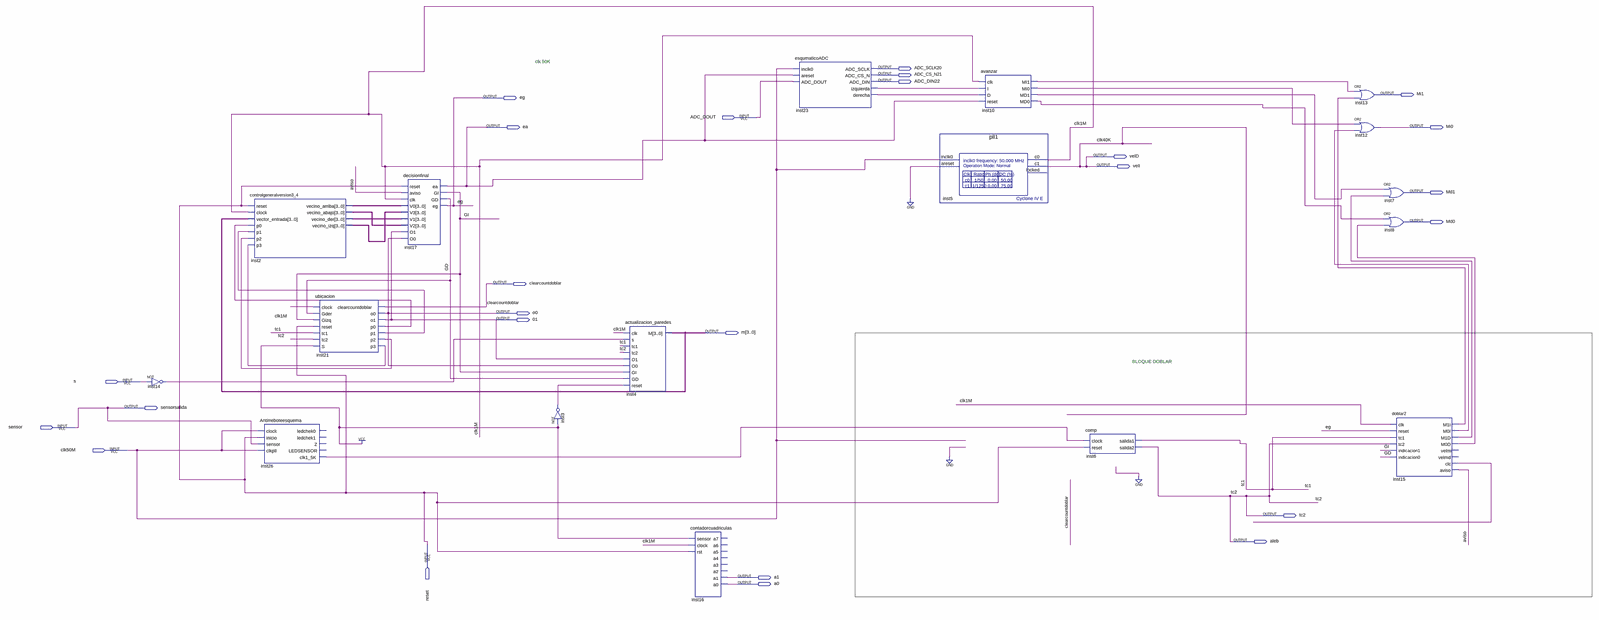
[diagram p0: schematic sheet, whole]
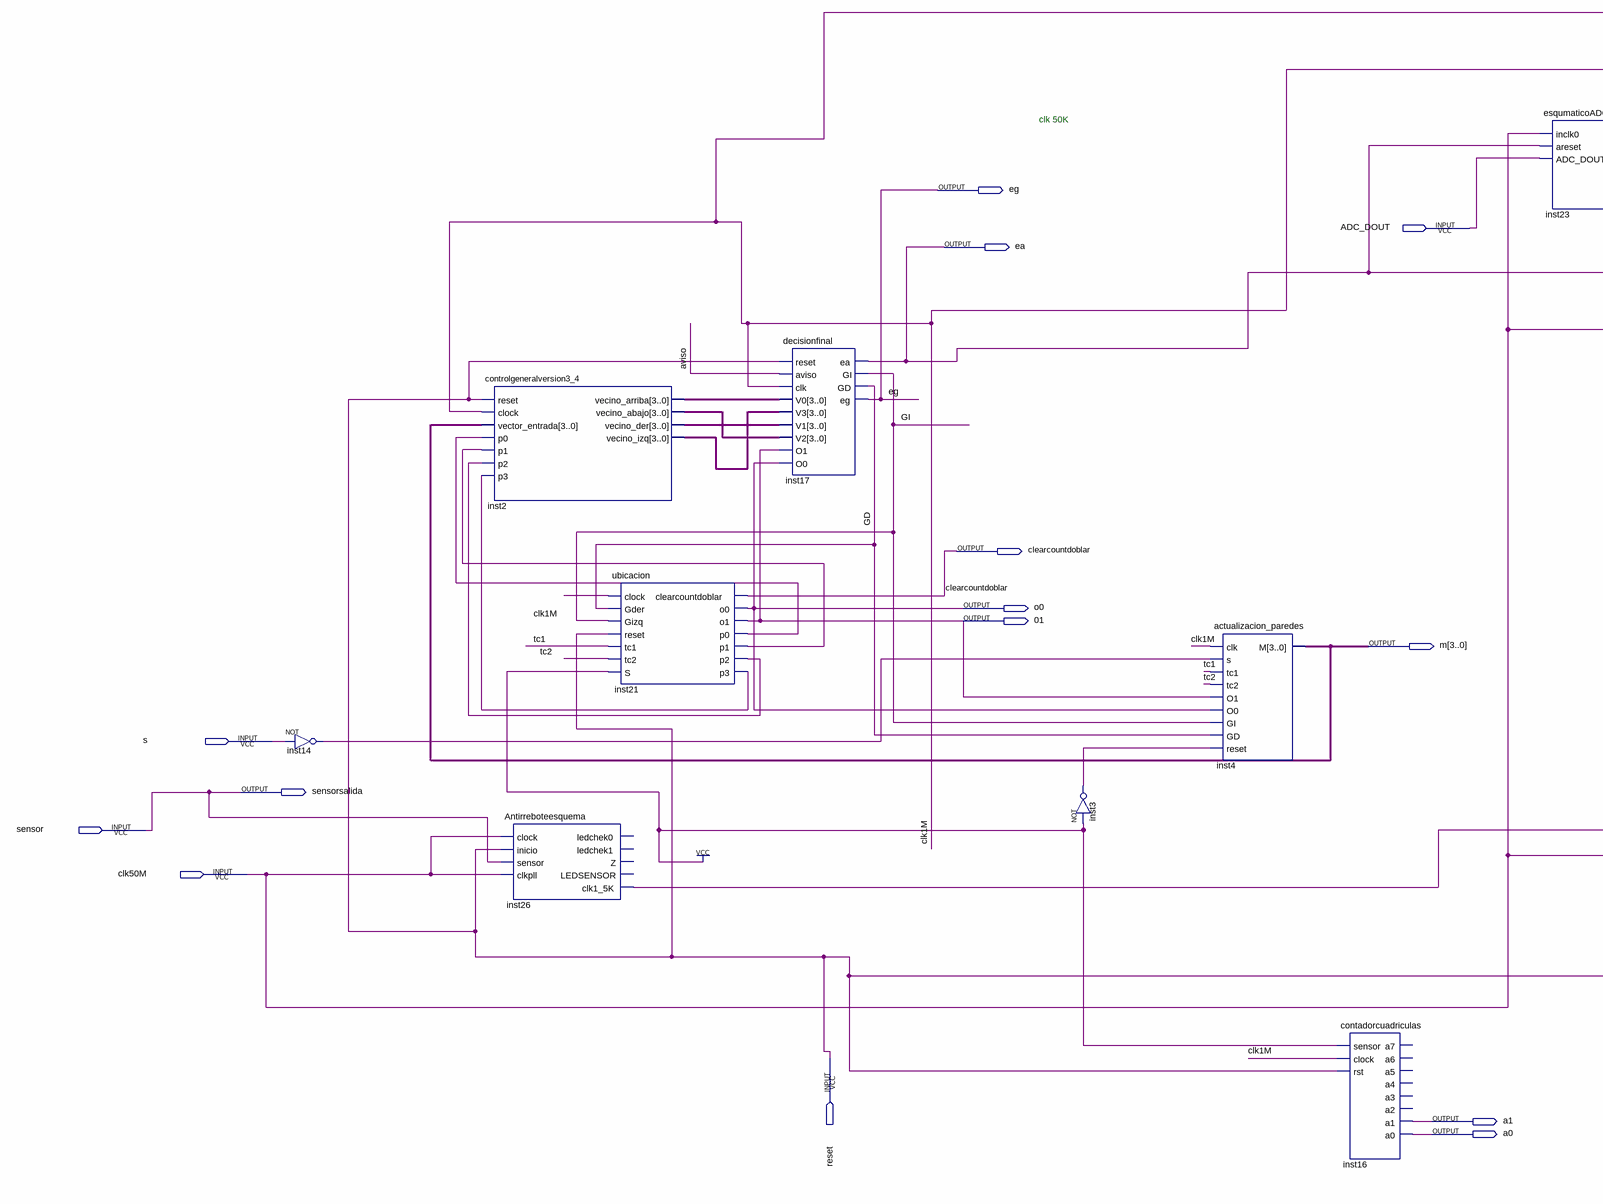
[diagram p1: schematic sheet, left part]
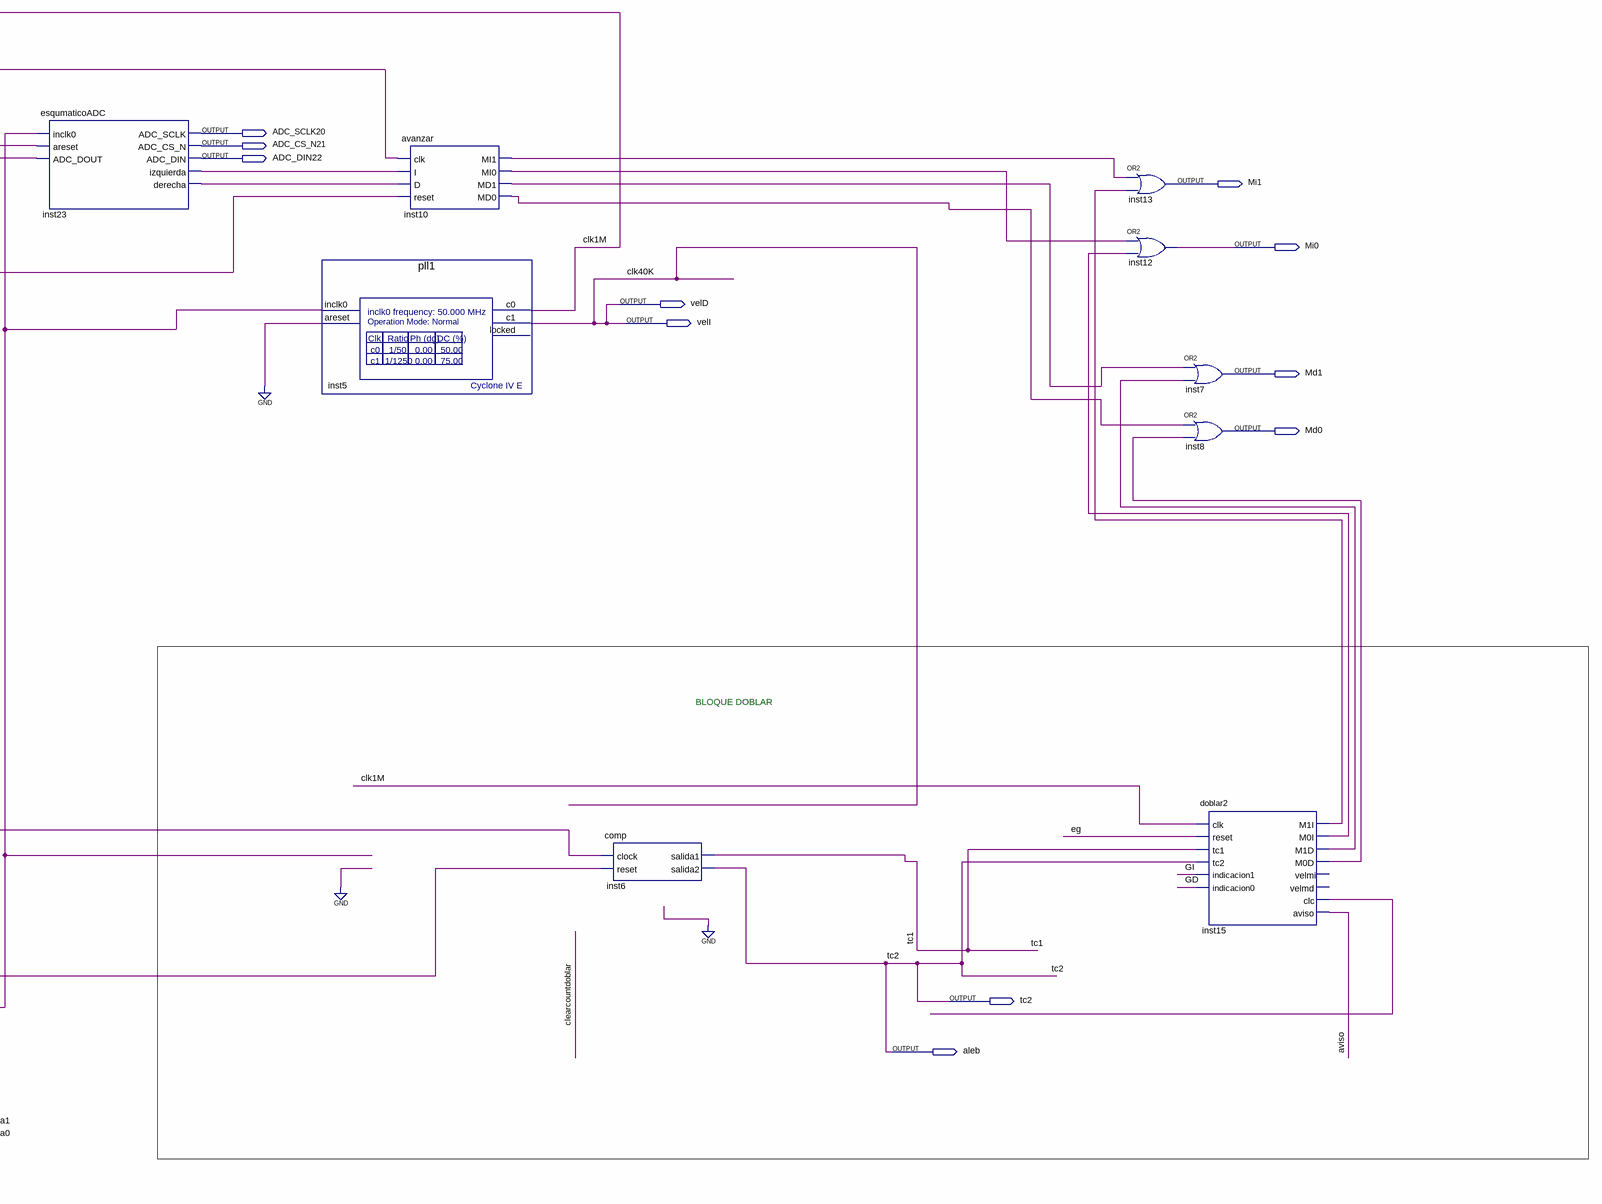
[diagram p2: schematic sheet, right part]
// Quartus schematic fin.bdf as structural Verilog: 17 symbols, 25 pins
module fin (
  input  ADC_DOUT,
  input  s,
  input  sensor,
  input  clk50M,
  input  reset,
  output ADC_SCLK20,
  output ADC_CS_N21,
  output ADC_DIN22,
  output Mi1,
  output eg,
  output ea,
  output Mi0,
  output velD,
  output velI,
  output Md1,
  output Md0,
  output clearcountdoblar,
  output o0,
  output \01 ,
  output [3:0] m,
  output sensorsalida,
  output tc2,
  output aleb,
  output a1,
  output a0
);

  wire aviso, clk1M, GD, GI, inst3_out, inst10_md0, inst10_md1, inst10_mi0, inst10_mi1, inst14_out,
       inst15_clc, inst15_m0d, inst15_m0i, inst15_m1d, inst15_m1i, inst21_p0, inst21_p1, inst21_p2,
       inst21_p3, inst23_derecha, inst23_izquierda, inst26_clk1_5k, tc1;
  wire [3:0] inst2_vecino_abajo, inst2_vecino_arriba, inst2_vecino_der, inst2_vecino_izq;

  not inst14 (inst14_out, s);
  controlgeneralversion3_4 inst2 (
    .reset(reset), .clock(clk1M), .vector_entrada(m), .p0(inst21_p0), .p1(inst21_p1), .p2(inst21_p2),
    .p3(inst21_p3), .vecino_arriba(inst2_vecino_arriba), .vecino_abajo(inst2_vecino_abajo),
    .vecino_der(inst2_vecino_der), .vecino_izq(inst2_vecino_izq));
  Antirreboteesquema inst26 (
    .clock(clk50M), .inicio(reset), .sensor(sensor), .clkpll(clk50M), .clk1_5K(inst26_clk1_5k));  // open: ledchek0, ledchek1, Z, LEDSENSOR
  ubicacion inst21 (
    .clock(clk1M), .Gder(GD), .Gizq(GI), .reset(reset), .tc1(tc1), .tc2(aleb), .S(1'b1),
    .clearcountdoblar(clearcountdoblar), .o0(o0), .o1(\01 ), .p0(inst21_p0), .p1(inst21_p1), .p2(inst21_p2),
    .p3(inst21_p3));
  decisionfinal inst17 (
    .reset(reset), .aviso(aviso), .clk(clk1M), .V0(inst2_vecino_arriba), .V3(inst2_vecino_izq),
    .V1(inst2_vecino_der), .V2(inst2_vecino_abajo), .O1(\01 ), .O0(o0), .ea(ea), .GI(GI), .GD(GD), .eg(eg));
  not inst3 (inst3_out, 1'b1);
  actualizacion_paredes inst4 (
    .clk(clk1M), .s(inst14_out), .tc1(tc1), .tc2(aleb), .O1(\01 ), .O0(o0), .GI(GI), .GD(GD),
    .reset(inst3_out), .M(m));
  contadorcuadriculas inst16 (
    .sensor(1'b1), .clock(clk1M), .rst(reset), .a1(a1), .a0(a0));  // open: a7, a6, a5, a4, a3, a2
  esqumaticoADC inst23 (
    .inclk0(clk50M), .areset(ea), .ADC_DOUT(ADC_DOUT), .ADC_SCLK(ADC_SCLK20), .ADC_CS_N(ADC_CS_N21),
    .ADC_DIN(ADC_DIN22), .izquierda(inst23_izquierda), .derecha(inst23_derecha));
  pll1 inst5 (.inclk0(clk50M), .areset(1'b0), .c0(clk1M), .c1(velD));  // open: locked
  avanzar inst10 (
    .clk(clk1M), .I(inst23_izquierda), .D(inst23_derecha), .reset(ea), .MI1(inst10_mi1), .MI0(inst10_mi0),
    .MD1(inst10_md1), .MD0(inst10_md0));
  comp inst6 (.clock(inst26_clk1_5k), .reset(reset), .salida1(tc1), .salida2(aleb));
  or inst13 (Mi1, inst10_mi1, inst15_m1i);
  or inst12 (Mi0, inst10_mi0, inst15_m0i);
  or inst7 (Md1, inst10_md1, inst15_m1d);
  or inst8 (Md0, inst10_md0, inst15_m0d);
  doblar2 inst15 (
    .clk(clk1M), .reset(eg), .tc1(tc1), .tc2(aleb), .indicacion1(GI), .indicacion0(GD), .M1I(inst15_m1i),
    .M0I(inst15_m0i), .M1D(inst15_m1d), .M0D(inst15_m0d), .clc(inst15_clc), .aviso(aviso));  // open: velmi, velmd

  assign sensorsalida = sensor;
  assign tc2 = aleb;
  assign velI = velD;

  // Other names for the same wires on the sheet: clk40K = velD

  // Notes on the sheet:
  //   clk 50K
  //   BLOQUE DOBLAR
endmodule
